# EAGLE design power_dispatch_v1 (EAGLE 6.5.0)
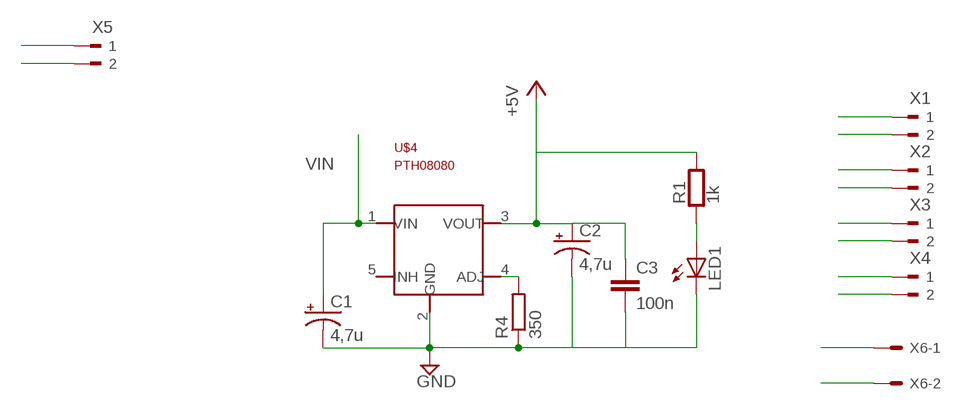
[diagram p0: schematic, sheet 1]

## Parts
C1  4,7u  CAP_POLPTH2  [CPOL-RADIAL-10UF-25V]
C2  4,7u  CAP_POLPTH2  [CPOL-RADIAL-10UF-25V]
C3  100n  CAPPTH2  [CAP-PTH-SMALL2]
LED1  LEDSML0805  [SML0805]
R1  1k  R0805  [0805]
R4  350  R-EU_R0805  [R0805]
U$4  PTH08080  [PTH08080EUF]
X1  90-2  [90-2]
X2  90-2  [90-2]
X3  90-2  [90-2]
X4  90-2  [90-2]
X5  90-2  [90-2]
X6  KK-156-2  [KK-156-2]

## Nets
+5V: C2.1(+) C3.1 R1.2 U$4.3(VOUT) X6.1
GND: C1.2(-) C2.2(-) C3.2 LED1.C R4.1 U$4.2(GND) X1.2 X2.2 X3.2 X4.2 X5.2 X6.2
N$5: R4.2 U$4.4(ADJ)
N$12: LED1.A R1.1
VIN: C1.1(+) U$4.1(VIN) X1.1 X2.1 X3.1 X4.1 X5.1
Unconnected: U$4.5(INH)

## Library data of the parts
C1 C2 = SparkFun-Passives:CAP_POL: Capacitor Polarized These are standard SMD and PTH capacitors. Normally 10uF, 47uF, and 100uF in electrolytic and tantalum varieties. Always verify the external diameter of the through hole cap, it varies with capacity, voltage, and manufacturer. The EIA devices should be standard.
C3 = SparkFun-Passives:CAP: Capacitor Standard 0603 ceramic capacitor, and 0.1" leaded capacitor.
LED1 = led:LED: LED OSRAM: - CHIPLED LG R971, LG N971, LY N971, LG Q971, LY Q971, LO R971, LY R971 LH N974, LH R974 LS Q976, LO Q976, LY Q976 LO Q996 - Hyper CHIPLED LW Q18S LB Q993, LB Q99A, LB R99A - SideLED LS A670, LO A670, LY A670, LG A670, LP A670 LB A673, LV A673, LT A673, LW A673 LH A674 LY A675 LS A676, LA A676, LO A676, LY A676, LW A676 LS A679, LY A679, LG A679 - Hyper Micro SIDELED® LS Y876, LA Y876, LO Y876, LY Y876 LT Y87S - SmartLED LW L88C, LW L88S LB L89C, LB L89S, LG L890 LS L89K, LO L89K, LY L89K LS L896, LA L896, LO L896, LY L896 - TOPLED LS T670, LO T670, LY T670, LG T670, LP T670 LSG T670, LSP T670, LSY T670, LOP T670, LYG T670 LG T671, LOG T671, LSG T671 LB T673, LV T673, LT T673, LW T673 LH T674 LS T676, LA T676, LO T676, LY T676, LB T676, LH T676, LSB T676, LW T676 LB T67C, LV T67C, LT T67C, LS T67K, LO T67K, LY T67K, LW E67C LS E67B, LA E67B, LO E67B, LY E67B, LB E67C, LV E67C, LT E67C LW T67C LS T679, LY T679, LG T679 LS T770, LO T770, LY T770, LG T770, LP T770 LB T773, LV T773, LT T773, LW T773 LH T774 LS E675, LA E675, LY E675, LS T675 LS T776, LA T776, LO T776, LY T776, LB T776 LHGB T686 LT T68C, LB T68C - Hyper Mini TOPLED® LB M676 - Mini TOPLED Santana® LG M470 LS M47K, LO M47K, LY M47K Source: http://www.osram.convergy.de LUXEON: - LUMILED® LXK2-PW12-R00, LXK2-PW12-S00, LXK2-PW14-U00, LXK2-PW14-V00 LXK2-PM12-R00, LXK2-PM12-S00, LXK2-PM14-U00 LXK2-PE12-Q00, LXK2-PE12-R00, LXK2-PE12-S00, LXK2-PE14-T00, LXK2-PE14-U00 LXK2-PB12-K00, LXK2-PB12-L00, LXK2-PB12-M00, LXK2-PB14-N00, LXK2-PB14-P00, LXK2-PB14-Q00 LXK2-PR12-L00, LXK2-PR12-M00, LXK2-PR14-Q00, LXK2-PR14-R00 LXK2-PD12-Q00, LXK2-PD12-R00, LXK2-PD12-S00 LXK2-PH12-R00, LXK2-PH12-S00 LXK2-PL12-P00, LXK2-PL12-Q00, LXK2-PL12-R00 Source: www.luxeon.com KINGBRIGHT: KA-3528ASYC Source: www.kingbright.com
R1 = mbed-rlcq:R
R4 = rcl:R-EU_: RESISTOR, European symbol
U$4 = PTH08080:PTH08080: DC-DC, Vin 5..18V, Vout 2..6V, 2A www.ti.com
X1-X5 = con-weidmueller-sl35:90-2: WEIDMUELLER CLAMP CONNECTOR; OC_FARNELL: unknown; OC_NEWARK: unknown
X6 = con-molex:KK-156-2: KK 156 HEADER Source: http://www.molex.com/pdm_docs/sd/026604100_sd.pdf; OC_FARNELL: unknown; OC_NEWARK: unknown

## Net classes
0 VIN: width 12.6 mm

## Board
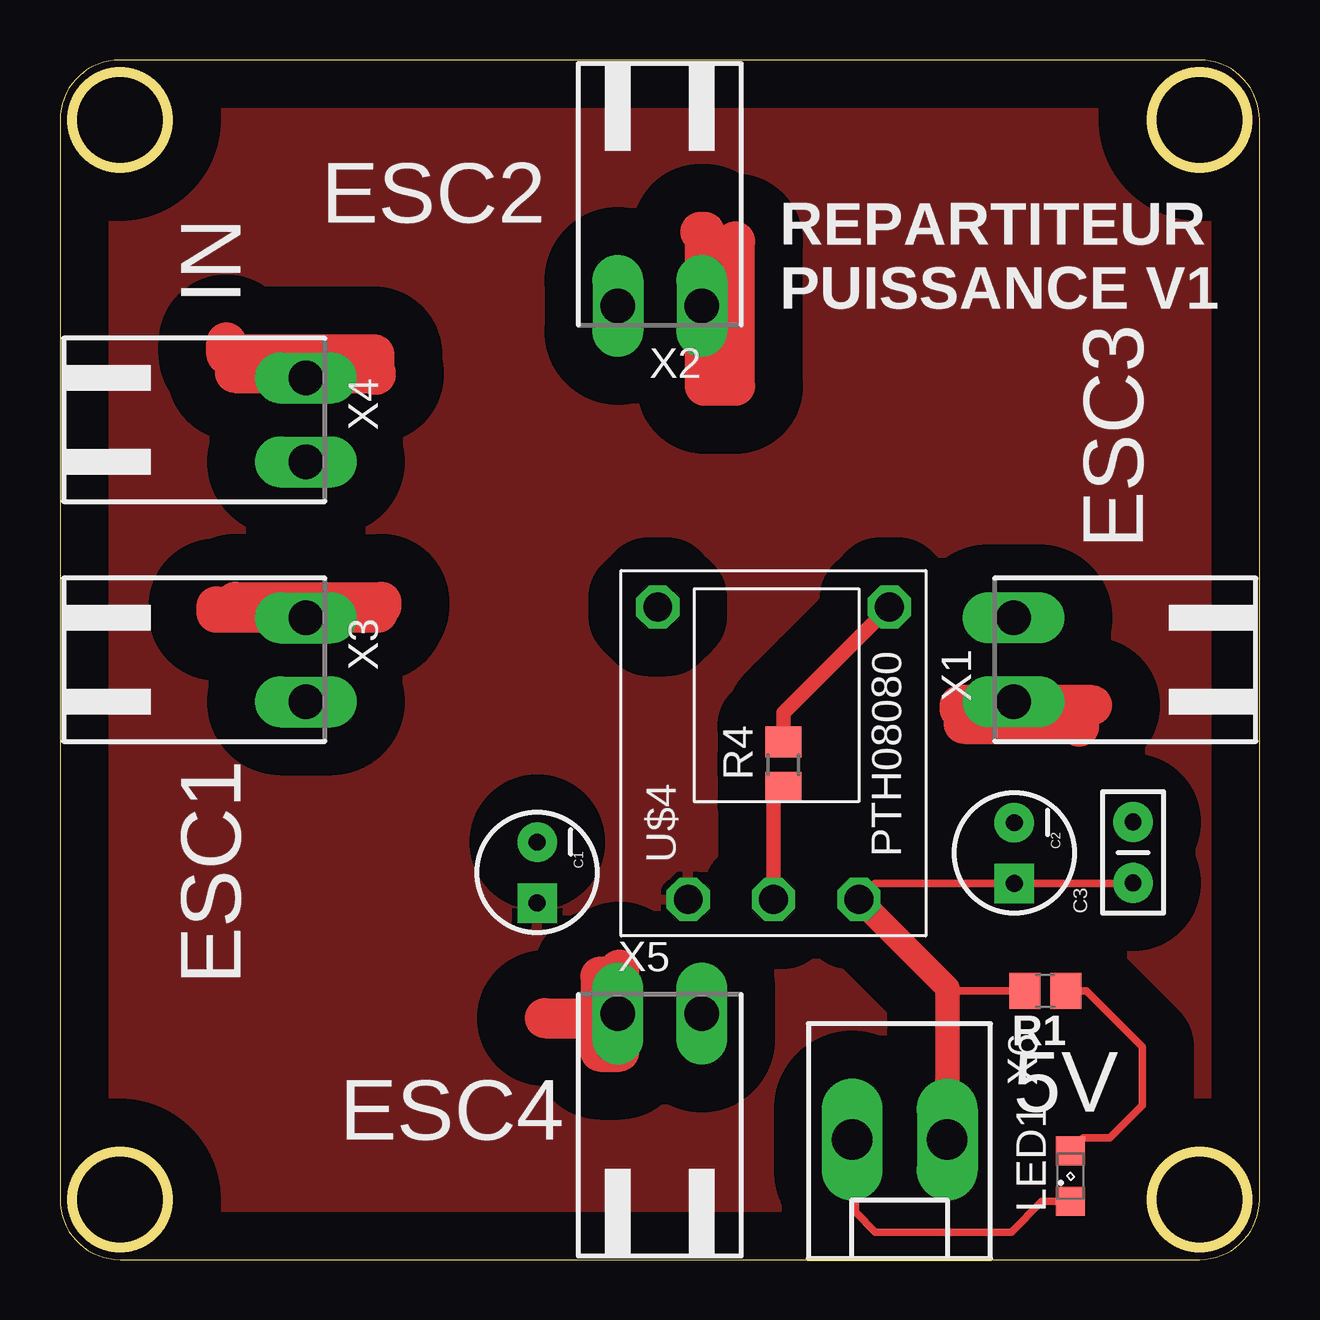
[diagram p1: board, top side]
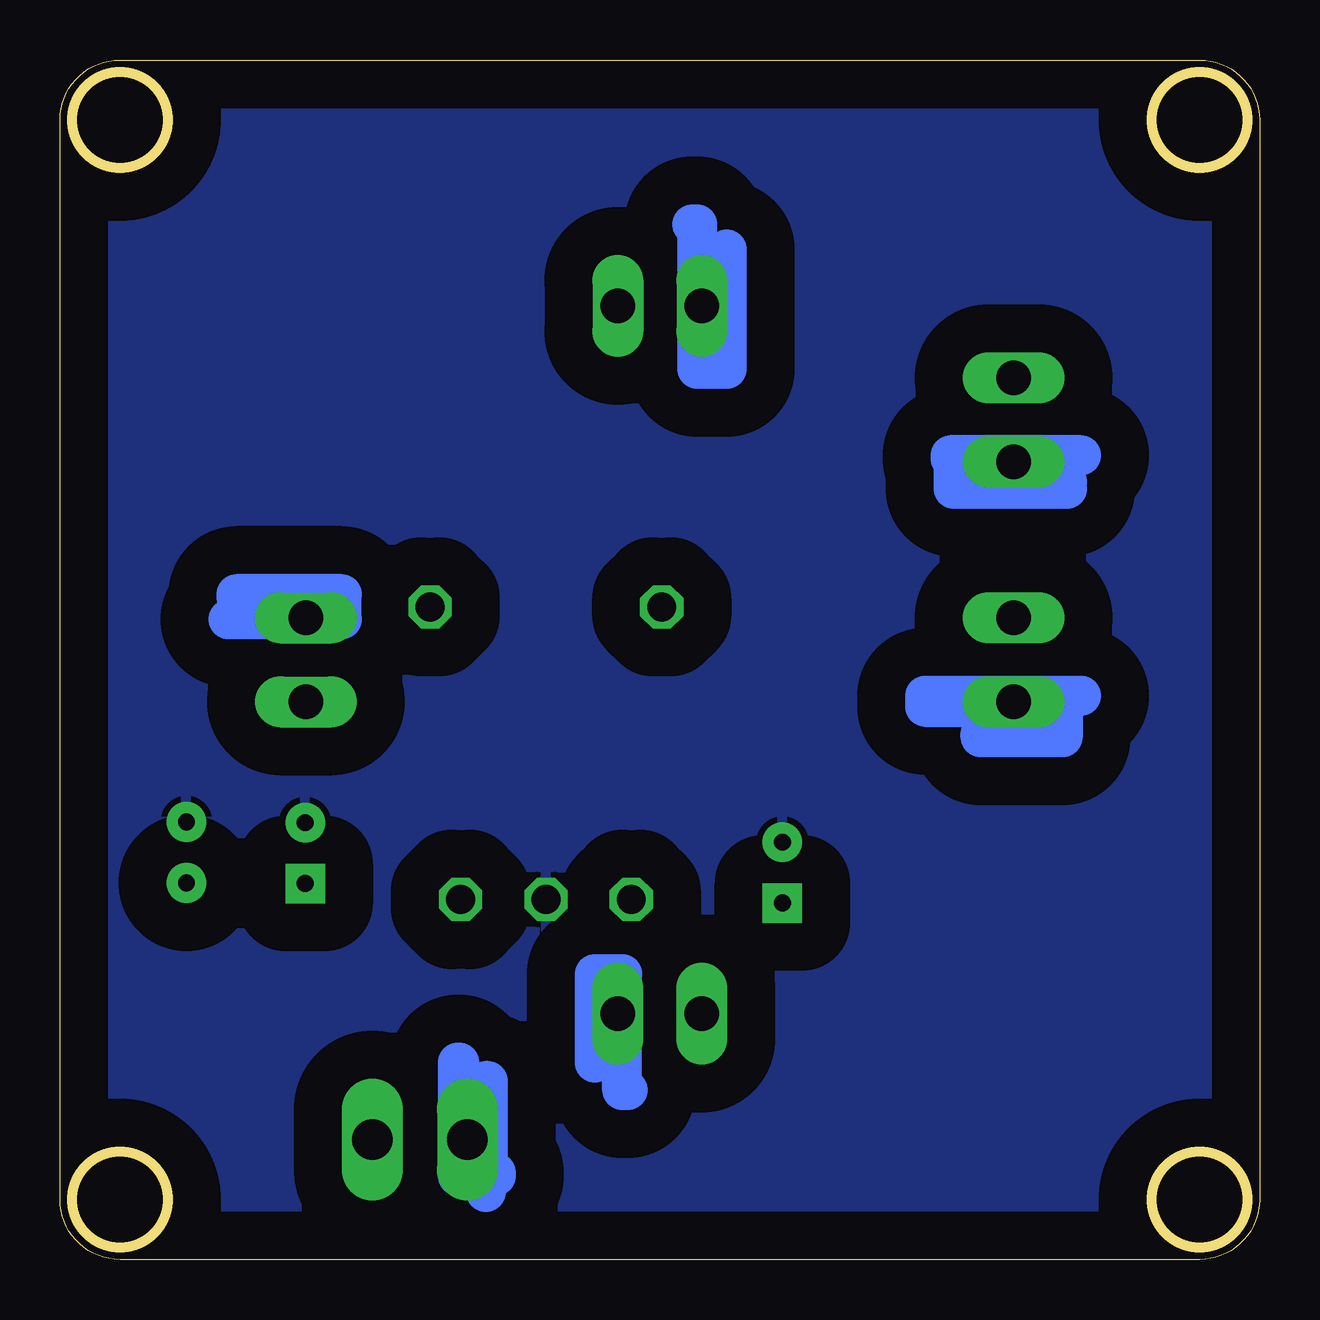
[diagram p2: board, bottom side, seen from below]

Size 50 x 50 mm. Coordinates in mm from the lower left corner, seen from the top.
Outline: 0,47.5 0,2.5 arc90 2.5,0 47.5,0 arc90 50,2.5 50,47.5 arc90 47.5,50 2.5,50 arc90 0,47.5
Outline: circle at 2.5,47.5 radius 2
Outline: circle at 47.5,47.5 radius 2
Outline: circle at 2.5,2.5 radius 2
Outline: circle at 47.5,2.5 radius 2
Copper layers (1*16): Top 0.035mm / dielectric 1.5mm / Bottom 0.035mm
Design rules "default": minimum track width 10mil, minimum drill 24mil, track to track 8mil, track to pad 8mil, pad to pad 8mil, via to via 8mil, smd to smd 8mil, copper to edge 40mil, drill to drill 8mil, minimum pad ring 10mil, minimum via ring 8mil, stop-mask expansion 4mil, vias tented up to drill 0mil, thermal gap 10mil

### Footprints (pad centres in the part's own frame; a part is rotated, then mirrored left to right if it is on the bottom)
CPOL-RADIAL-10UF-25V = drill 0.7 pad 1.651 square: 1 1.27,0 | drill 0.7 pad 1.651: 2 -1.27,0
CAP-PTH-SMALL2 = drill 0.7 pad 1.651: 1 0,0; 2 2.54,0
SML0805 = smd 1.2 x 1.2: A 1.05,0; C -1.05,0
0805 = smd 1.3 x 1.5: 1 -0.85,0; 2 0.85,0
R0805 = smd 1.3 x 1.5: 1 -0.95,0; 2 0.95,0
PTH08080EUF = drill 1.2 octagon: 1 0,0; 2 0,-3.556; 3 0,-7.112; 4 12.192,-8.382; 5 12.192,1.27
90-2 = drill 1.422 long: 1 -1.75,5.25; 2 1.75,5.25
KK-156-2 = drill 1.7 pad 2.184 long: 1 -1.98,0; 2 1.98,0

### Placement (x,y rotation side)
C1  19.89,16.13 270 top
C2  39.78,16.94 270 top
C3  44.73,15.7 90 top
LED1  42.11,3.48 90 top
R1  41.07,11.2 180 top
R4  30.15,20.62 90 top
U$4  26.19,15.01 90 top
X1  45,25 90 top
X2  25,45 180 top
X3  5,25 270 top
X4  5,35 270 top
X5  25,5 0 top
X6  35,5 180 top

### Tracks (layer width: path | path; a pad name or v marks a point on that pad's centre or on a via)
+5V
  Top 0.305: R1.2 37.11,11.2 36.98,11.33 | U$4.3 33.96,15.67 C2.1 44.7,15.67 C3.1
  Top 1.016: X6.1 36.98,11.33 U$4.3
GND
  Top 0.305: LED1.C 40.94,2.43 39.65,1.14 33.98,1.14 33.15,1.98 33.15,4.87 X6.2
  Top 0.61: U$4.2 29.74,19.27 R4.1
  pour Bottom (isolate 2): -0.94,51.79 54.28,51.79 54.28,-5.77 -0.94,-5.77
N$1
  Top 1.676: 20.22,10.06 22.61,10.06 22.61,11.79 22.53,11.79 22.53,8.66 23.32,8.66 23.32,12.09
N$2
  Top 1.676: 7.32,27.41 13.39,27.41 13.39,27.23 13.26,27.23 13.26,26.95 6.53,26.95 6.53,27.23
N$3
  Top 1.676: 7.29,36.96 13.16,36.96 13.16,36.88 13.11,36.88 13.11,37.72 6.93,37.72 6.93,38.23
N$4
  Top 1.676: 26.7,42.82 26.87,42.82 26.87,36.42 28.14,36.42 28.14,42.44
N$5
  Top 0.61: R4.2 30.15,22.78 U$4.4
N$6
  Top 1.676: 43.03,23.11 37.49,23.11 37.49,22.94 37.67,22.94 37.67,22.33 42.47,22.33 42.47,22.2
N$7
  Bottom 1.676: 42.98,26.7 38.25,26.7 38.25,27.74 42.65,27.74 42.65,27.61
N$8
  Bottom 1.676: 33.35,8.2 33.43,8.2 33.43,3.48 31.83,3.48 31.83,3.63 32.16,3.63 32.16,7.44 32.26,7.44 32.26,2.82
N$9
  Bottom 1.676: 7.44,23.5 13.95,23.5 13.95,23.04 8.2,23.04 8.2,21.77 11.63,21.77 11.63,21.95
N$10
  Bottom 1.676: 7.44,33.53 12.88,33.53 12.88,33.38 12.75,33.38 12.75,32.13 8.03,32.13 8.03,32.41
N$11
  Bottom 1.676: 23.65,43.16 23.44,43.16 23.44,37.13 22.2,37.13 22.2,42.11
N$12
  Top 0.305: R1.1 42.77,11.2 45.11,8.87 45.11,6.43 43.76,5.08 42.66,5.08 LED1.A
N$13
  Bottom 1.676: 26.34,7.06 26.57,7.06 26.57,11.89 27.71,11.89 27.71,8.2
VIN
  pour Top (isolate 2): -1.47,52.45 56.31,52.45 56.31,-8.89 -1.47,-8.89

### Text on the board
tPlace: ESC2 | IN | REPARTITEUR / PUISSANCE V1 | ESC3 | ESC1 | 5V | ESC4